# Altium project manipulator1.PrjPcb
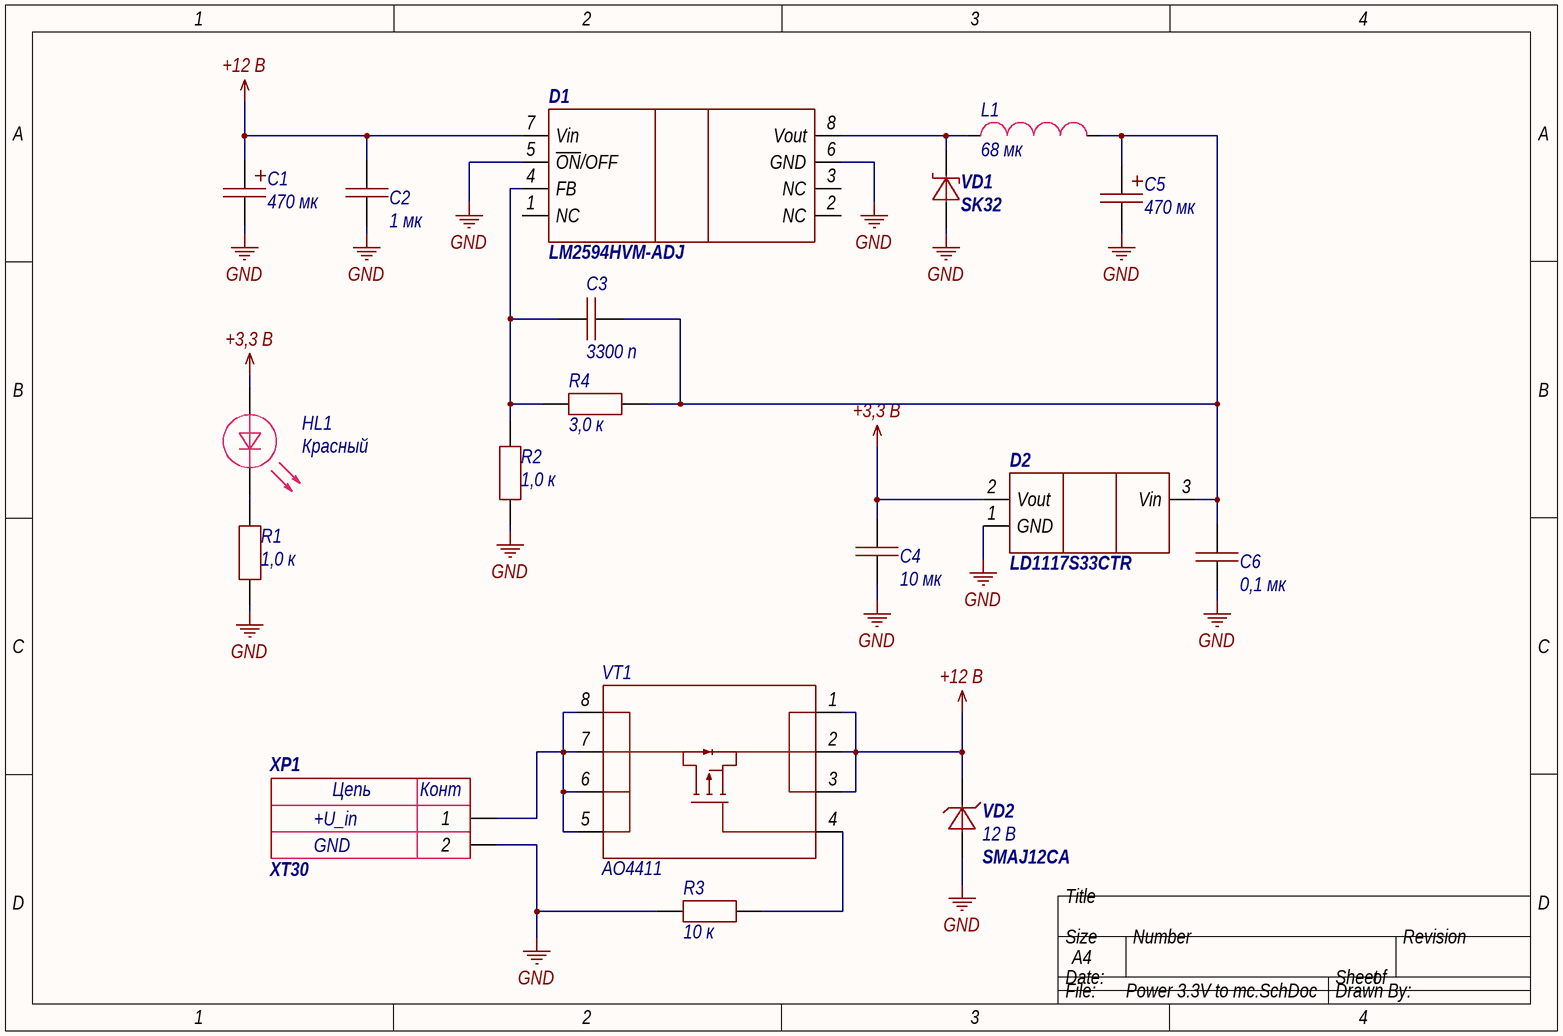
[diagram p0: Power 3.3V to mc.SchDoc]
3 sheets, 57 parts. Net scope: flat (ports and power ports of the same name join across sheets).
Board files: PCBtest.PcbDoc, PCBtest2.PcbDoc, Board_v1_p1.PcbDoc, Board_v1_p2.PcbDoc, Board_v2.PcbDoc
Sheets:
  Power 3.3V to mc.SchDoc
  MC_stm32.SchDoc
  RS485.SchDoc

## Sheet Power 3.3V to mc.SchDoc
size A4; SheetNumber: 1; SheetTotal: 3

### Parts
C1  value 470 мк  [RADIAL-2_10mm]  (hidden comment: Capacitor_polar)
C2  value 1 мк  [0603C]  (hidden comment: Capacitor)
C3  value 3300 п  [0603C]  (hidden comment: Capacitor)
C4  value 10 мк  [1210C]  (hidden comment: Capacitor)
C5  value 470 мк  [RADIAL-2_10mm]  (hidden comment: Capacitor_polar)
C6  value 0,1 мк  [0603C]  (hidden comment: Capacitor)
D1  LM2594HVM-ADJ  [SOIC-8]
D2  LD1117S33CTR  [SOT223]
HL1  Color: Красный  [0805D]  (hidden comment: LED)
L1  value 68 мк  [7.3x7.3]  (hidden comment: B82472G6683M)
R1  value 1,0 к  [0603R]  (hidden comment: Resistor)
R2  value 1,0 к  [0603R]  (hidden comment: Resistor)
R3  value 10 к  [0603R]  (hidden comment: Resistor)
R4  value 3,0 к  [0603R]  (hidden comment: Resistor)
VD1  SK32  [SMC]
VD2  SMAJ12CA  value 12 В  [SMA]
VT1  AO4411  [SOIC-8]
XP1  XT30  Value2: GND  Value1: +U_in  [XT30]

### Nets
+3,3 В: C4.1 D2.2(Vout) HL1.1
+12 В: C1.1 C2.1 D1.7(Vin) VD2.2 VT1.1 VT1.2 VT1.3
GND: C1.2 C2.2 C4.2 C5.2 C6.2 D1.5(~{ON}/OFF) D1.6(GND) D2.1(GND) R1.2 R2.1 R3.1 VD1.1 VD2.1 XP1.2
NetC3_1: C3.1 D1.4(FB) R2.2 R4.1
NetC3_2: C3.2 C5.1 C6.1 D2.3(Vin) L1.2 R4.2
NetD1_8: D1.8(Vout) L1.1 VD1.2
NetHL1_2: HL1.2 R1.1
NetR3_2: R3.2 VT1.4
NetVT1_5: VT1.5 VT1.6 VT1.7 VT1.8 XP1.1

Not connected (* = marked no-connect by the designer): D1 1(NC) 2(NC) 3(NC)

### Notes on the sheet
- (in symbol XT30) Цепь; Конт

### Library data of the parts
C1 C5 = 4,7 мк: Конденсатор электролит. 470 мкФ, 25 В, 10 мм; Part Number: Capacitor_polar
C2 = Capacitor_1u_10_50V_X7R_0603C: Конденсатор; Tolerance: 0,1; Voltage (V): 50; Dielectric: X7R; Capacity (nF): 1000; Part Number: Capacitor_1u_10_50V_X7R_0603C
C3 = Capacitor_3,3n_10_50V_X7R_0603C: Конденсатор; Tolerance: 0,1; Voltage (V): 50; Dielectric: X7R; Capacity (nF): 3,3; Part Number: Capacitor_3,3n_10_50V_X7R_0603C
C4 = Capacitor_10u_10_35V_X7R_1210C: Конденсатор; Tolerance: 0,1; Voltage (V): 35; Dielectric: X7R; Capacity (nF): 10000; Part Number: Capacitor_10u_10_35V_X7R_1210C
C6 = Capacitor_0,1u_10_50V_X7R_0603C: Конденсатор; Tolerance: 0,1; Voltage (V): 50; Dielectric: X7R; Capacity (nF): 100; Part Number: Capacitor_0,1u_10_50V_X7R_0603C
D1 = LM2594HVM-ADJ: DC-DC преобразователь; Part Number: LM2594HVM-ADJ
D2 = LD1117S33CTR: Линейный стабилизатор напряжения; Part Number: LD1117S33CTR
HL1 = LED: Светодиод; Part Number: LED
L1 = B82472G6683M: B82472G6683M, ЧИП-индуктивность экранированная 68мкГн ±20%, 0.82A, 26мОм; Part Number: B82472G6683M
R1 R2 = Resistor_1.0k_1_0603: Резистор номиналом 1,0 кОм и точностью 1%; Power: *; Part Number: Resistor_1.0k_1_0603; Tolerance: 1%
R3 = Resistor_10k_1_0603: Резистор номиналом 10 кОм и точностью 1%; Power: *; Part Number: Resistor_10k_1_0603; Tolerance: 1%
R4 = Resistor_3.0k_1_0603: Резистор номиналом 3,0 кОм и точностью 1%; Power: *; Part Number: Resistor_3.0k_1_0603; Tolerance: 1%
VD1 = SK32: Диод шоттки на 20 В, номинальный ток 3 А; Voltage nominal (V): 20; Current (A): 3; Part Number: SK32
VD2 = SMAJ12CA: Защитный диод на 12 В, рассеиваемая мощность 400 Вт; Voltage nominal (V): 12; Power (W): 400; Part Number: SMAJ12CA
VT1 = AO4411: P-канальный MOSFET; Part Number: AO4411
XP1 = XT30: 2-пиновый разъем с ключом; Part Number: XT30

## Sheet MC_stm32.SchDoc
size 420 x 297 mm; SheetNumber: 2; SheetTotal: 3
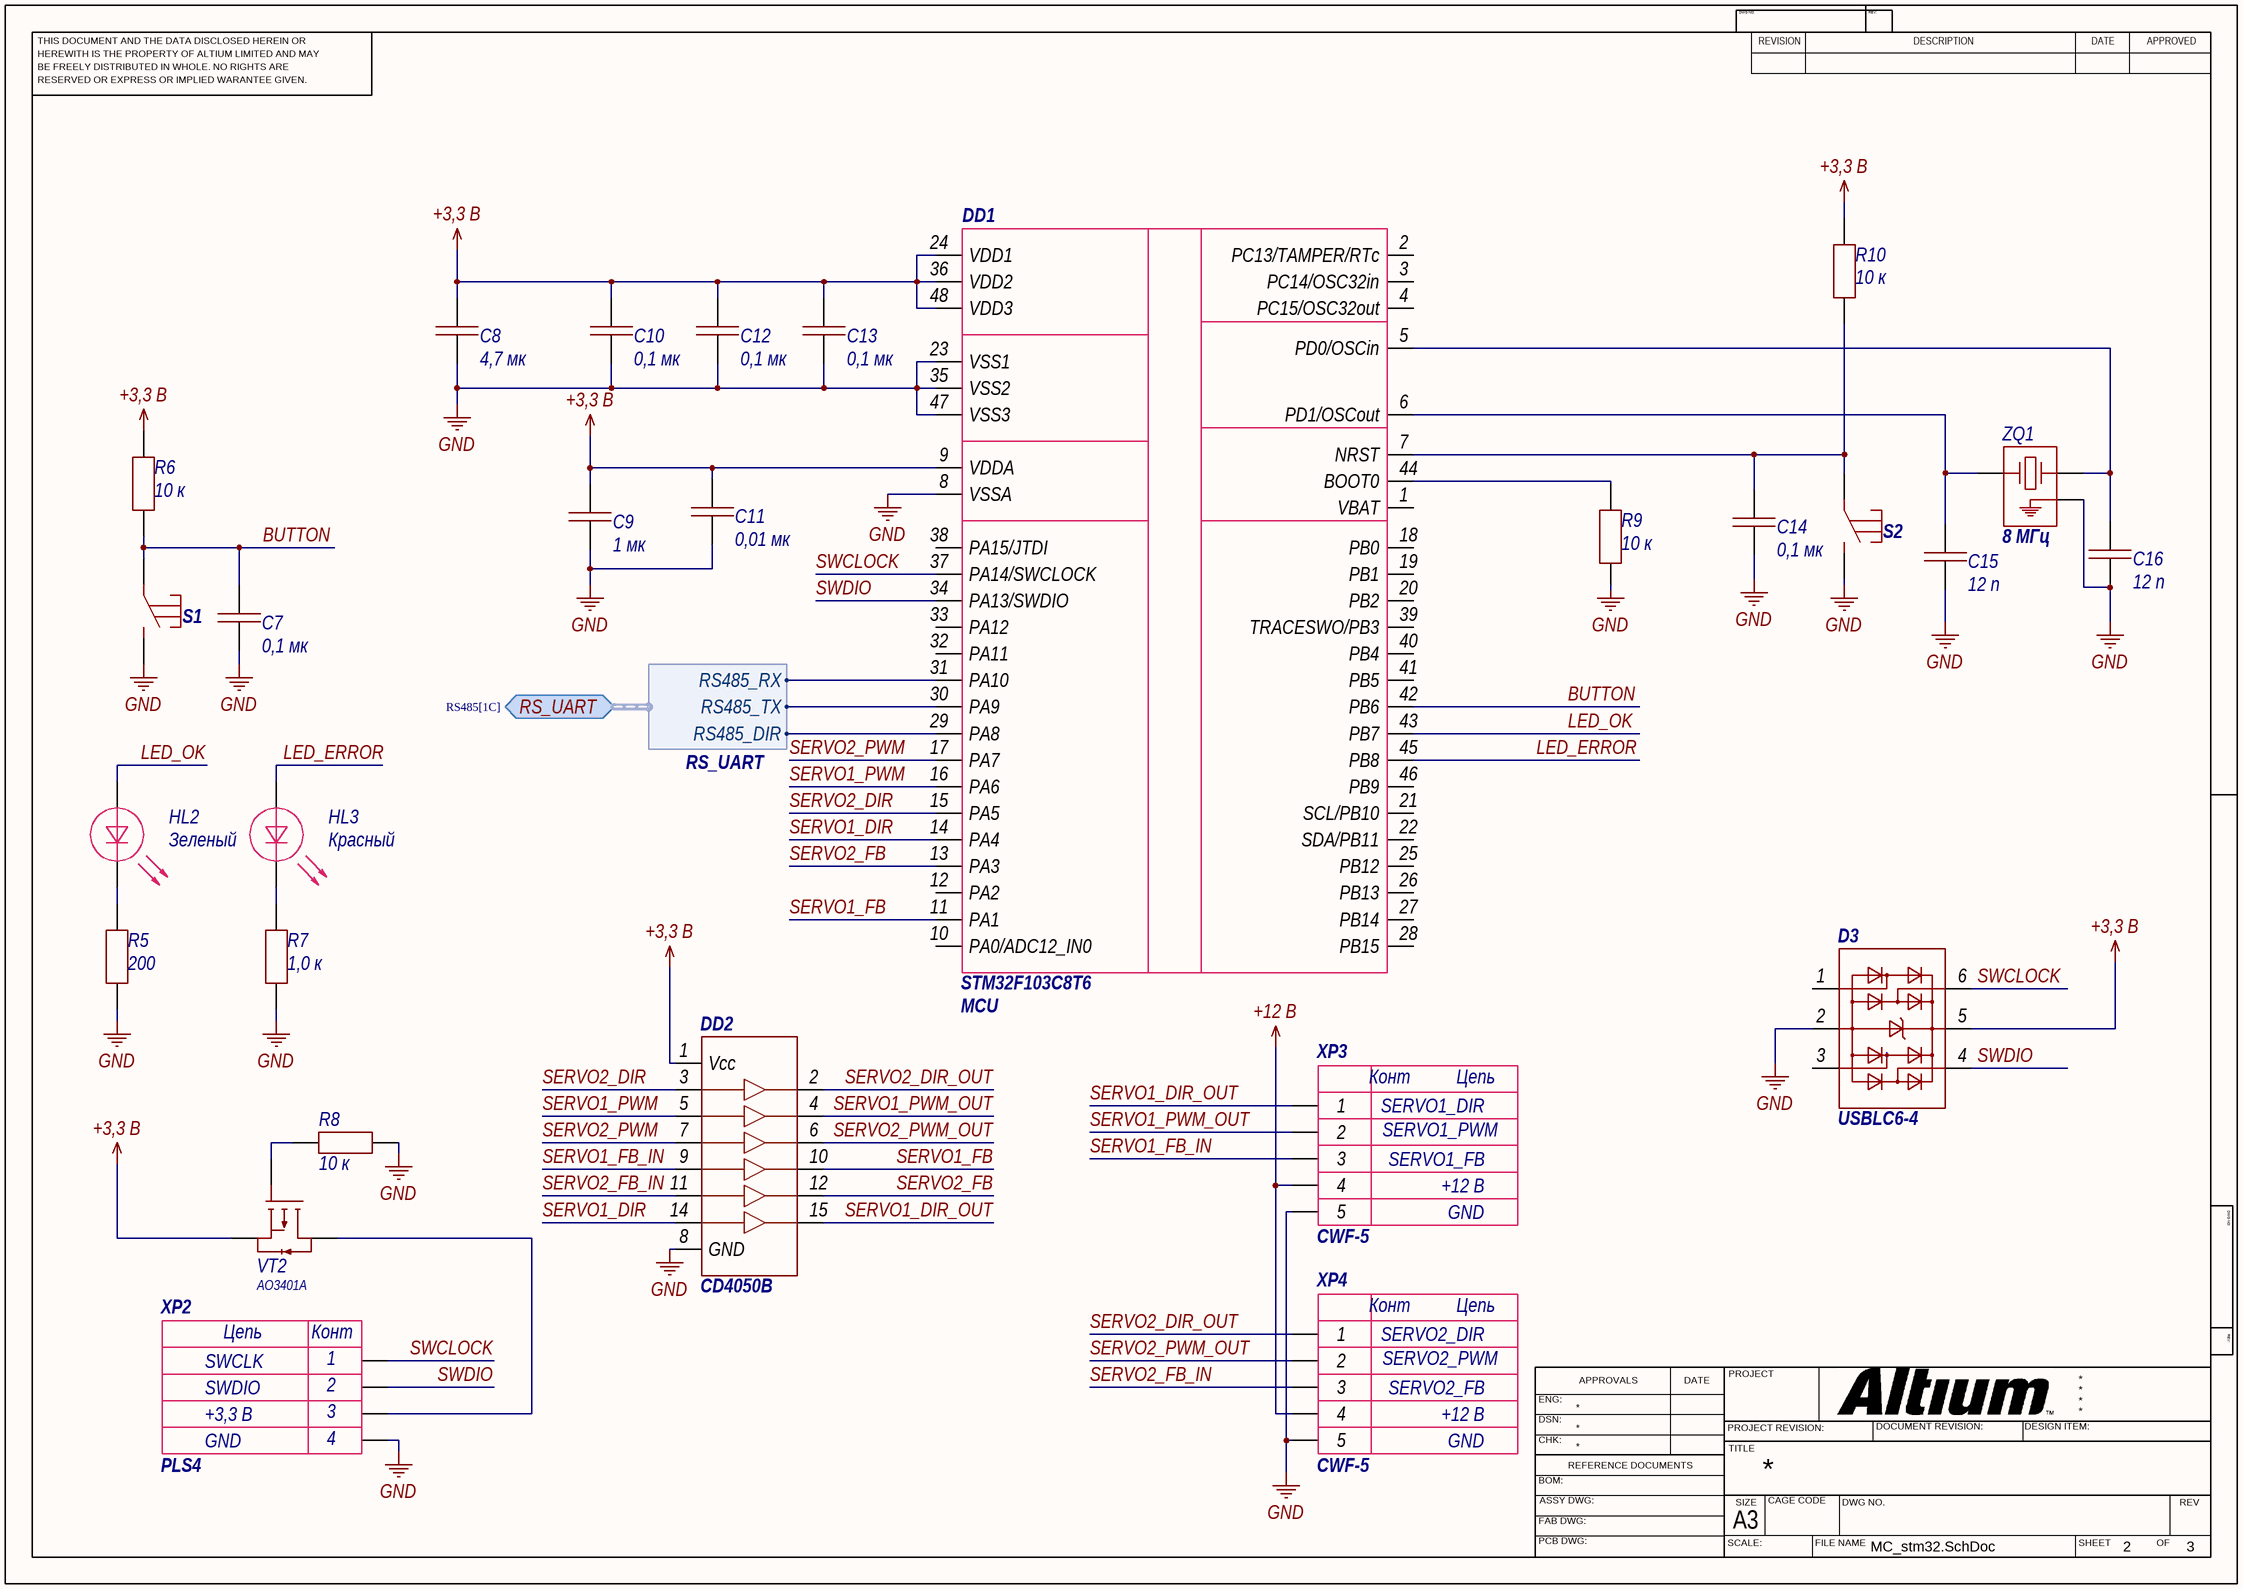
[diagram p1: MC_stm32.SchDoc]

### Parts
C7  value 0,1 мк  [0603C]  (hidden comment: Capacitor)
C8  value 4,7 мк  [1206C]  (hidden comment: Capacitor)
C9  value 1 мк  [0603C]  (hidden comment: Capacitor)
C10  value 0,1 мк  [0603C]  (hidden comment: Capacitor)
C11  value 0,01 мк  [0603C]  (hidden comment: Capacitor)
C12  value 0,1 мк  [0603C]  (hidden comment: Capacitor)
C13  value 0,1 мк  [0603C]  (hidden comment: Capacitor)
C14  value 0,1 мк  [0603C]  (hidden comment: Capacitor)
C15  value 12 п  [0603C]  (hidden comment: Capacitor)
C16  value 12 п  [0603C]  (hidden comment: Capacitor)
D3  USBLC6-4  [SOT23-6]
DD1  STM32F103C8T6  Value1: MCU  [LQFP48]
DD2  CD4050B  [SOIC-16]
HL2  Color: Зеленый  [0805D]  (hidden comment: LED)
HL3  Color: Красный  [0805D]  (hidden comment: LED)
R5  value 200  [0603R]  (hidden comment: Resistor)
R6  value 10 к  [0603R]  (hidden comment: Resistor)
R7  value 1,0 к  [0603R]  (hidden comment: Resistor)
R8  value 10 к  [0603R]  (hidden comment: Resistor)
R9  value 10 к  [0603R]  (hidden comment: Resistor)
R10  value 10 к  [0603R]  (hidden comment: Resistor)
S1  Tact_button  [Button_SMD_10mm]  (value not drawn)
S2  Tact_button  [Button_SMD_10mm]  (value not drawn)
VT2  AO3401A  [SOT23-3]
XP2  PLS4  Value3: +3,3 В  Value2: SWDIO  Value4: GND  Value1: SWCLK  [PLS4]
XP3  CWF-5  Value2: SERVO1_PWM  Value3: SERVO1_FB  Value4: +12 В  Value5: GND  [CWF-5]
XP4  CWF-5  Value1: SERVO2_DIR  Value2: SERVO2_PWM  Value3: SERVO2_FB  Value4: +12 В  Value5: GND  [CWF-5]
ZQ1  value 8 МГц  [QSMD3.2x2.5]  (hidden comment: XTAL_GND)

### Ports
RS_UART (bidir, harness RS_UART, see RS485[1C])

### Harnesses
RS_UART: RS485_TX, RS485_DIR, RS485_RX

### Nets
+3,3 В: C8.1 C9.2 C10.2 C11.2 C12.2 C13.2 D3.5 DD1.9(VDDA) DD1.24(VDD1) DD1.36(VDD2) DD1.48(VDD3) DD2.1(Vcc) R6.1 R10.2 VT2.2
+12 В: XP3.4 XP4.4
GND: C7.1 C8.2 C9.1 C10.1 C11.1 C12.1 C13.1 C14.1 C15.2 C16.2 D3.2 DD1.8(VSSA) DD1.23(VSS1) DD1.35(VSS2) DD1.47(VSS3) DD2.8(GND) R5.2 R7.2 R8.2 R9.2 S1.2 S2.2 XP2.4 XP3.5 XP4.5 ZQ1.3
BUTTON: C7.2 DD1.42(PB6) R6.2 S1.1
LED_ERROR: DD1.45(PB8) HL3.1
LED_OK: DD1.43(PB7) HL2.1
SERVO1_DIR: DD1.14(PA4) DD2.14(A6)
SERVO1_DIR_OUT: DD2.15(Y6) XP3.1
SERVO1_FB: DD1.11(PA1) DD2.10(Y10)
SERVO1_FB_IN: DD2.9(A4) XP3.3
SERVO1_PWM: DD1.16(PA6) DD2.5(A2)
SERVO1_PWM_OUT: DD2.4(Y2) XP3.2
SERVO2_DIR: DD1.15(PA5) DD2.3(A1)
SERVO2_DIR_OUT: DD2.2(Y1) XP4.1
SERVO2_FB: DD1.13(PA3) DD2.12(Y5)
SERVO2_FB_IN: DD2.11(A5) XP4.3
SERVO2_PWM: DD1.17(PA7) DD2.7(A3)
SERVO2_PWM_OUT: DD2.6(Y3) XP4.2
SWCLOCK: D3.6 DD1.37(PA14/SWCLOCK) XP2.1
SWDIO: D3.4 DD1.34(PA13/SWDIO) XP2.2
NetC14_2: C14.2 DD1.7(NRST) R10.1 S2.1
NetC15_1: C15.1 DD1.6(PD1/OSCout) ZQ1.1
NetC16_1: C16.1 DD1.5(PD0/OSCin) ZQ1.2
NetDD1_29: DD1.29(PA8) ; port RS_UART.RS485_DIR
NetDD1_30: DD1.30(PA9) ; port RS_UART.RS485_TX
NetDD1_31: DD1.31(PA10) ; port RS_UART.RS485_RX
NetDD1_44: DD1.44(BOOT0) R9.1
NetHL2_2: HL2.2 R5.1
NetHL3_2: HL3.2 R7.1
NetR8_1: R8.1 VT2.1
NetVT2_3: VT2.3 XP2.3

Not connected (* = marked no-connect by the designer): D3 1(9) 3(11); DD1 1(VBAT) 2(PC13/TAMPER/RTc) 3(PC14/OSC32in) 4(PC15/OSC32out) 10(PA0/ADC12_IN0) 12(PA2) 18(PB0) 19(PB1) 20(PB2) 21(SCL/PB10) 22(SDA/PB11) 25(PB12) 26(PB13) 27(PB14) 28(PB15) 32(PA11) 33(PA12) 38(PA15/JTDI) 39(TRACESWO/PB3) 40(PB4) 41(PB5) 46(PB9)

### Notes on the sheet
- THIS DOCUMENT AND THE DATA DISCLOSED HEREIN OR
- HEREWITH IS THE PROPERTY OF ALTIUM LIMITED AND MAY
- DWG NO:
- REVISION
- REV:
- DESCRIPTION
- DATE
- APPROVED
- BE FREELY DISTRIBUTED IN WHOLE. NO RIGHTS ARE
- RESERVED OR EXPRESS OR IMPLIED WARANTEE GIVEN.
- ENG:
- APPROVALS
- PROJECT
- DSN:
- CHK:
- REFERENCE DOCUMENTS
- PROJECT REVISION:
- TITLE
- DOCUMENT REVISION:
- DESIGN ITEM:
- BOM:
- FAB DWG:
- PCB DWG:
- ASSY DWG:
- SCALE:
- A3
- SIZE
- CAGE CODE
- FILE NAME
- DWG NO.
- SHEET
- OF
- REV
- (in symbol CWF-5) Конт; Цепь
- (in symbol PLS4) Цепь; Конт

### Library data of the parts
C7 C10 C12-C14 = Capacitor_0,1u_10_50V_X7R_0603C: as C6 on sheet Power 3.3V to mc; Part Number: Capacitor_0,1u_10_50V_X7R_0603C
C8 = Capacitor_4,7u_10_50V_X7R_1206C: Конденсатор; Tolerance: 0,1; Voltage (V): 50; Dielectric: X7R; Capacity (nF): 4700; Part Number: Capacitor_4,7u_10_50V_X7R_1206C
C9 = Capacitor_1u_10_50V_X7R_0603C: as C2 on sheet Power 3.3V to mc; Part Number: Capacitor_1u_10_50V_X7R_0603C
C11 = Capacitor_10n_10_50V_X7R_0603C: Конденсатор; Tolerance: 0,1; Voltage (V): 50; Dielectric: X7R; Capacity (nF): 10; Part Number: Capacitor_10n_10_50V_X7R_0603C
C15 C16 = 0,1 мк: Конденсатор; Part Number: Capacitor
D3 = USBLC6-4: Сборка защитных диодов для USB; ComponentLink1Description: Shop; ComponentLink1URL: https://www.chipdip.ru/product0/8001780508; Part Number: USBLC6-4
DD1 = STM32F103C8T6: Микроконтроллер; Manufacturer: ST Microelectronics; Rate: -0,3...4,0В; Shop: магазин с самой дешевой ценой; Notice: 48 пиновая версия STM32F103; Datasheet: http://www.st.com/content/ccc/resource/technical/document/datasheet/33/d4/6f/1d/df/0b/4c/6d/CD00161566.pdf/files/CD00161566.pdf/jcr:content/translations/en.CD00161566.pdf; Case: корпус; Part Number: STM32F103C8T6
DD2 = CD4050B: Шесть буферных элементов; Part Number: CD4050B
HL2 HL3 = LED: Светодиод; Part Number: LED
R5 = Resistor_200_1_0603: Резистор номиналом 200 Ом и точностью 1%; Power: *; Part Number: Resistor_200_1_0603; Tolerance: 1%
R6 R8-R10 = Resistor_10k_1_0603: Резистор номиналом 10 кОм и точностью 1%; Power: *; Part Number: Resistor_10k_1_0603; Tolerance: 1%
R7 = Resistor_1.0k_1_0603: as R1 on sheet Power 3.3V to mc; Power: *; Part Number: Resistor_1.0k_1_0603; Tolerance: 1%
S1 S2 = Tact_button: Тактовая кнопка; Part Number: Tact_button
VT2 = AO3401A: P-канальный MOSFET; Part Number: AO3401A
XP2 = PLS4: Гребенка 4 пина; Part Number: PLS4
XP3 XP4 = CWF-5: 5-пиновый разъем с ключом; Part Number: CWF-5
  XP3: SERVO1_DIR: SERVO1_DIR
ZQ1 = XTAL_GND: WTL3M85421FO, Резонатор кварцевый 8МГц, 10PPM при 25°C, 20PPM при -40°С+85°C, 400Ом, 12пФ; Part Number: XTAL_GND

## Sheet RS485.SchDoc
size A4; SheetNumber: 3; SheetTotal: 3
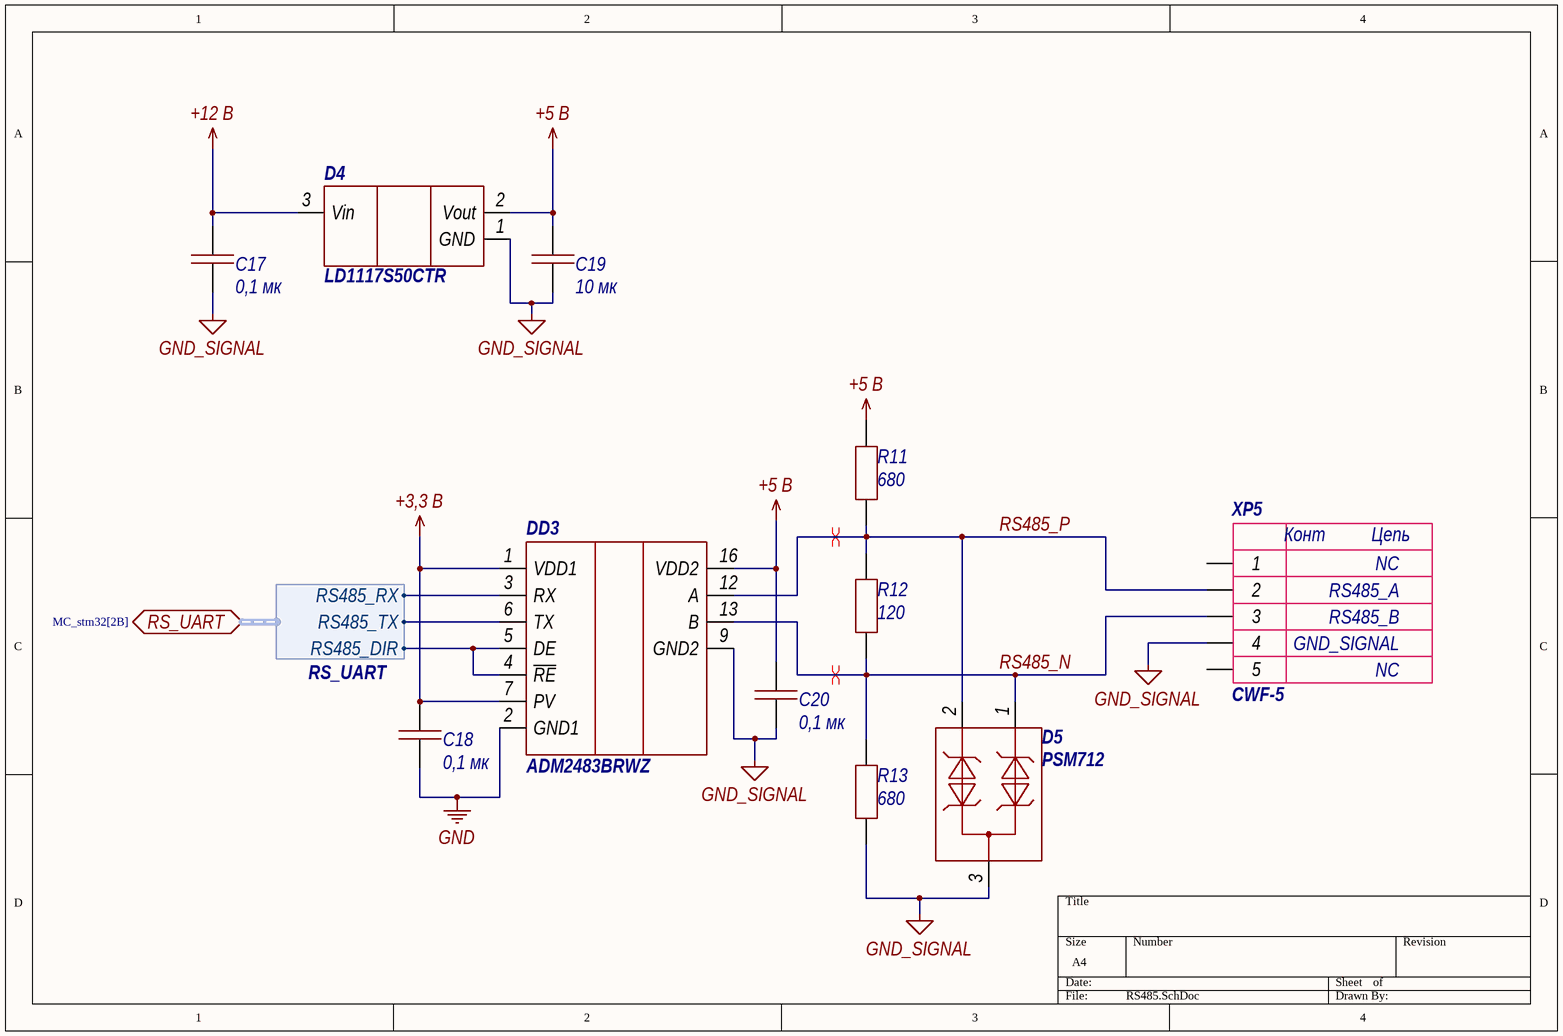
[diagram p2: RS485.SchDoc]

### Parts
C17  value 0,1 мк  [0603C]  (hidden comment: Capacitor)
C18  value 0,1 мк  [0603C]  (hidden comment: Capacitor)
C19  value 10 мк  [1210C]  (hidden comment: Capacitor)
C20  value 0,1 мк  [0603C]  (hidden comment: Capacitor)
D4  LD1117S50CTR  [SOT223]
D5  PSM712  [SOT23-3]
DD3  ADM2483BRWZ  [SOIC-16W]
R11  value 680  [0603R]  (hidden comment: Resistor)
R12  value 120  [1206R]  (hidden comment: Resistor)
R13  value 680  [0603R]  (hidden comment: Resistor)
XP5  CWF-5  Value1: NC  Value2: RS485_A  Value3: RS485_B  Value4: GND_SIGNAL  [CWF-5]

### Ports
RS_UART (bidir, harness RS_UART, see MC_stm32[2B])

### Harnesses
RS_UART: RS485_RX, RS485_TX, RS485_DIR

### Nets
+3,3 В: C18.2 DD3.1(VDD1) DD3.7(PV)
+5 В: C19.2 C20.2 D4.2(Vout) DD3.16(VDD2) R11.1
+12 В: C17.2 D4.3(Vin)
GND: C18.1 DD3.2(GND1)
GND_SIGNAL: C17.1 C19.1 C20.1 D4.1(GND) D5.3 DD3.9(GND2) R13.2 XP5.4
RS485_N: D5.1 DD3.13(B) R12.2 R13.1 XP5.3
RS485_P: D5.2 DD3.12(A) R11.2 R12.1 XP5.2
NetDD1_29: DD3.4(~{RE}) DD3.5(DE) ; port RS_UART.RS485_DIR
NetDD1_30: DD3.6(TX) ; port RS_UART.RS485_TX
NetDD1_31: DD3.3(RX) ; port RS_UART.RS485_RX

Not connected (* = marked no-connect by the designer): XP5 1 5

### Layout directives
differential pair: RS485_N, RS485_P

### Notes on the sheet
- (in symbol CWF-5) Конт; Цепь

### Library data of the parts
C17 C18 C20 = Capacitor_0,1u_10_50V_X7R_0603C: as C6 on sheet Power 3.3V to mc; Part Number: Capacitor_0,1u_10_50V_X7R_0603C
C19 = Capacitor_10u_10_35V_X7R_1210C: as C4 on sheet Power 3.3V to mc; Part Number: Capacitor_10u_10_35V_X7R_1210C
D4 = LD1117S50CTR: Линейный стабилизатор напряжения; Part Number: LD1117S50CTR
D5 = PSM712: Защитный диод для линии RS-485; Part Number: PSM712; Interface: RS-485
DD3 = ADM2483BRWZ: Прием передатчик RS485 с гальванической развязкой; Part Number: ADM2483BRWZ
R11 R13 = Resistor_680_1_0603: Резистор номиналом 680 Ом и точностью 1%; Power: *; Part Number: Resistor_680_1_0603; Tolerance: 1%
R12 = Resistor_120_1_0603: Резистор номиналом 120 Ом и точностью 1%; Power: *; Part Number: Resistor_120_1_0603; Tolerance: 1%
XP5 = CWF-5: 5-пиновый разъем с ключом; Value5: NC; Part Number: CWF-5

## Nets that join several sheets
+3,3 В: Power 3.3V to mc (C4.1 D2.2 HL1.1), MC_stm32 (15 pins), RS485 (C18.2 DD3.1 DD3.7)
+12 В: Power 3.3V to mc (7 pins), MC_stm32 (XP3.4 XP4.4), RS485 (C17.2 D4.3)
GND: Power 3.3V to mc (14 pins), MC_stm32 (26 pins), RS485 (C18.1 DD3.2)
NetDD1_29: MC_stm32 (DD1.29), RS485 (DD3.4 DD3.5)
NetDD1_30: MC_stm32 (DD1.30), RS485 (DD3.6)
NetDD1_31: MC_stm32 (DD1.31), RS485 (DD3.3)